# Altium schematic sheet MCU.SchDoc
size A4
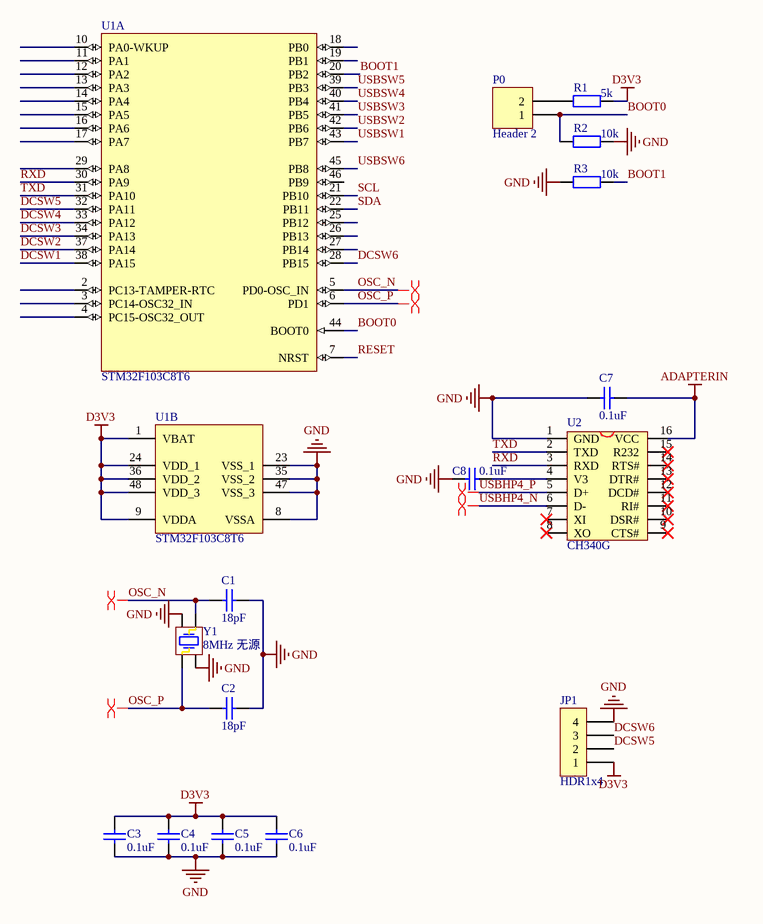
[diagram p0: MCU.SchDoc]

## Parts
C1  18pF  [0603C]
C2  18pF  [0603C]
C3  0.1uF  [0603C]
C4  0.1uF  [0603C]
C5  0.1uF  [0603C]
C6  0.1uF  [0603C]
C7  0.1uF  [0603C]
C8  0.1uF  [0603C]
JP1  HDR1x4  [XH-4-SIDE]
P0  Header 2  [HDR1X2]
R1  5k  [0603R]
R2  10k  [0603R]
R3  10k  [0603R]
U1  STM32F103C8T6  [LQFP48_N]  (parts A,B of 2)
U2  CH340G  [SOP-16]
Y1  8MHz 无源  [X3225]

## Nets
ADAPTERIN: C7.2 U2.16(VCC)
D3V3: C3.1 C4.1 C5.1 C6.1 JP1.1 R1.1 U1.1(VBAT) U1.9(VDDA) U1.24(VDD_1) U1.36(VDD_2) U1.48(VDD_3)
GND: C1.2 C2.2 C3.2 C4.2 C5.2 C6.2 C7.1 C8.1 JP1.4 R2.2 R3.2 U1.8(VSSA) U1.23(VSS_1) U1.35(VSS_2) U1.47(VSS_3) U2.1(GND) Y1.2(NA) Y1.4(NA)
BOOT0: P0.1 R2.1 U1.44(BOOT0)
BOOT1: R3.1 U1.20(PB2)
DCSW1: U1.38(PA15)
DCSW2: U1.37(PA14)
DCSW3: U1.34(PA13)
DCSW4: U1.33(PA12)
DCSW5: JP1.2 U1.32(PA11)
DCSW6: JP1.3 U1.28(PB15)
OSC_N: C1.1 U1.5(PD0-OSC_IN) Y1.3(OSC2)
OSC_P: C2.1 U1.6(PD1) Y1.1(OSC1)
RESET: U1.7(NRST)
RXD: U1.30(PA9) U2.3(RXD)
SCL: U1.21(PB10)
SDA: U1.22(PB11)
TXD: U1.31(PA10) U2.2(TXD)
USBHP4_N: U2.6(D-)
USBHP4_P: U2.5(D+)
USBSW1: U1.43(PB7)
USBSW2: U1.42(PB6)
USBSW3: U1.41(PB5)
USBSW4: U1.40(PB4)
USBSW5: U1.39(PB3)
USBSW6: U1.45(PB8)
NetC8_2: C8.2 U2.4(V3)
NetP0_2: P0.2 R1.2

Not connected (* = marked no-connect by the designer): U1 2(PC13-TAMPER-RTC) 3(PC14-OSC32_IN) 4(PC15-OSC32_OUT) 10(PA0-WKUP) 11(PA1) 12(PA2) 13(PA3) 14(PA4) 15(PA5) 16(PA6) 17(PA7) 18(PB0) 19(PB1) 25(PB12) 26(PB13) 27(PB14) 29(PA8) 46(PB9); U2 7(XI)* 8(XO)* 9(CTS#)* 10(DSR#)* 11(RI#)* 12(DCD#)* 13(DTR#)* 14(RTS#)* 15(R232)*

## Layout directives
differential pair: OSC_N, OSC_P, USBHP4_N, USBHP4_P

## Library data of the parts
C1-C8 = Cap: Capacitor; Published: 8-Jun-2000; LatestRevisionDate: 17-Jul-2002; LatestRevisionNote: Re-released for DXP Platform.; PackageReference: RAD-0.3; Publisher: Altium Limited
  C1 C2: Value: 18pF
  C3-C8: Value: 0.1uF
JP1 = HDR1x4: Connector
P0 = Header 2: Header, 2-Pin; LatestRevisionDate: 17-Jul-2002; LatestRevisionNote: Re-released for DXP Platform.; Publisher: Altium Limited
R1-R3 = RES: Resistor; Value: 1K; Published: 8-Jun-2000; Revision: July-2002: Re-released for DXP Platform.; Publisher: Altium Limited
U1 = STM32F103C8T6: STM32 ARM-based 32-bit MCU Performance Line with 64 kB Flash, 20 kB Internal RAM, -40 to +85癈 Temperature, 48-Pin LQFP, Tray; DatasheetVersion: rev13.0, Apr-2011; PackageVersion: rev13, Apr-2011; PackageReference: LQFP48; PackageDescription: 48-Pin Low-Profile Quad Flat Pack, 7 x 7 mm Body, 0.5 mm Pitch (LQFP48); ComponentLink1Description: Manufacturer URL; ComponentLink1URL: http://www.st.com/; ComponentLink2Description: STM32F103 Datasheet; ComponentLink2URL: http://www.st.com/internet/com/TECHNICAL_RESOURCES/TECHNICAL_LITERATURE/DATASHEET/CD00161566.pdf; ComponentLink3Description: STM32 Family Web Page; ComponentLink3URL: www.st.com/stm32
U2 = CH340G: USB2UART
Y1 = XTAL_1: Crystal Oscillator; Published: 8-Jun-2000; LatestRevisionDate: 17-Jul-2002; LatestRevisionNote: Re-released for DXP Platform.; PackageReference: R38; Publisher: Altium Limited; Value: 8MHz 无源